# EAGLE schematic main_v2 (EAGLE 7.2.0)
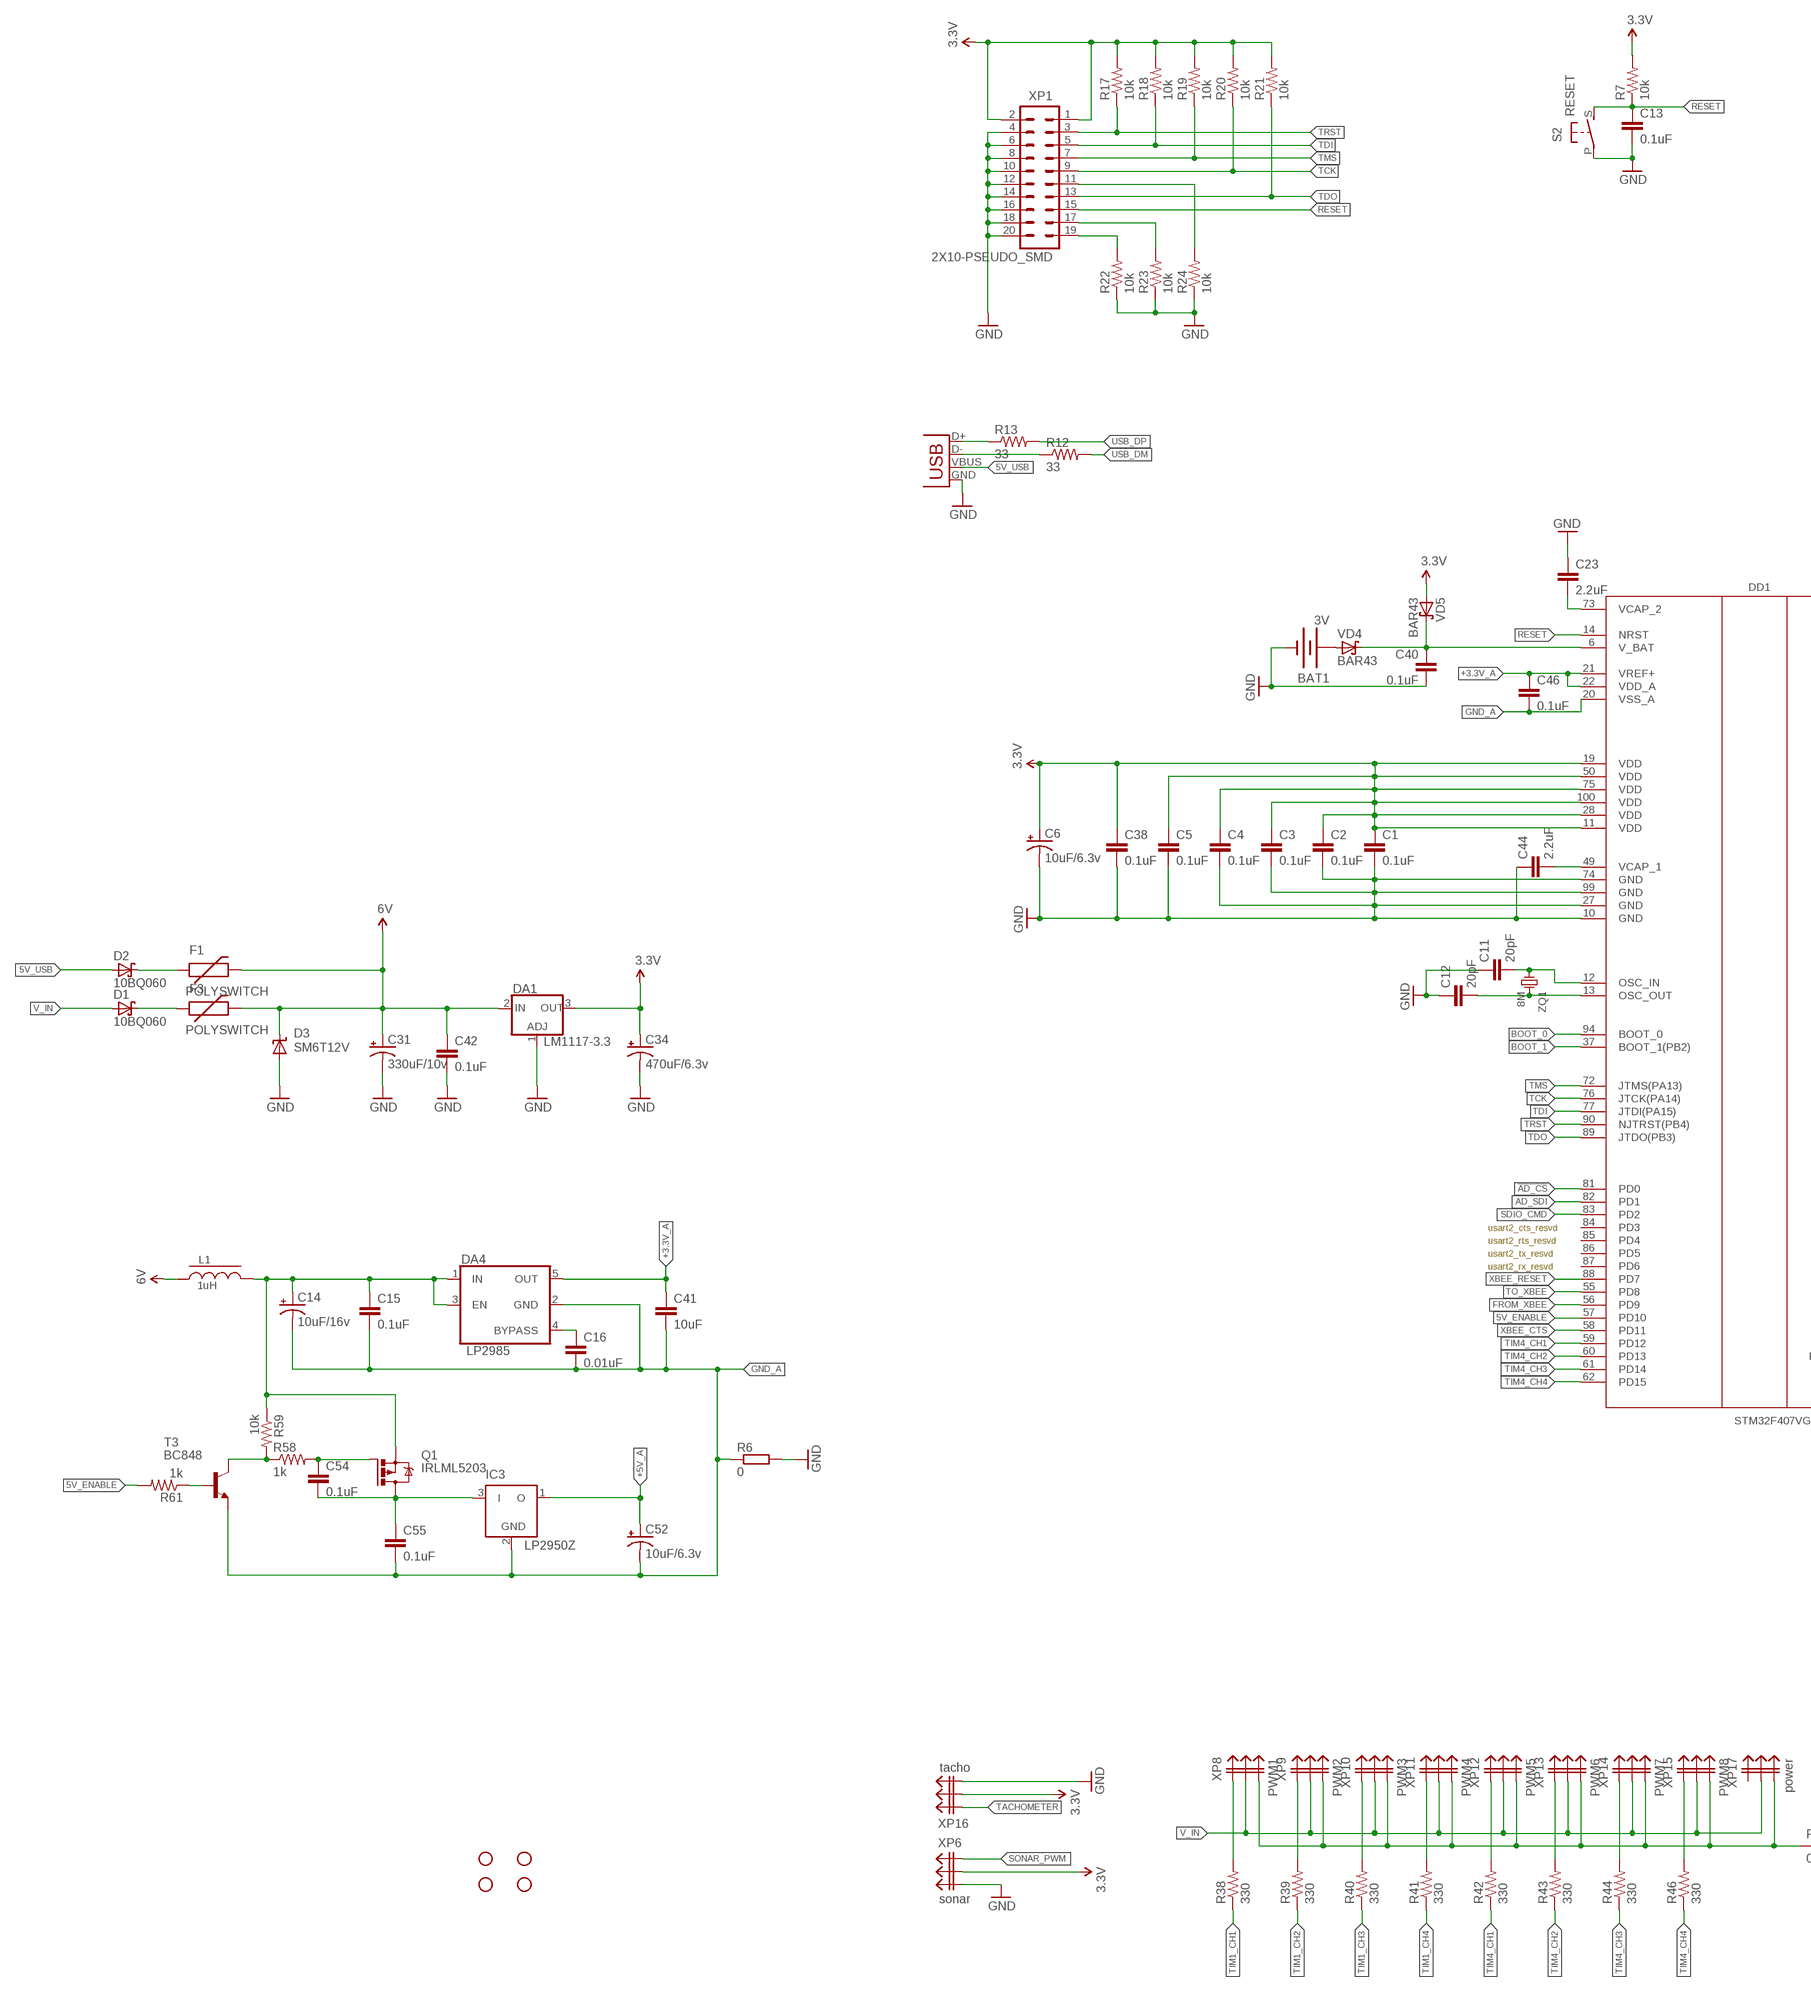
[diagram p0: schematic, sheet 1, part 1 of 3]
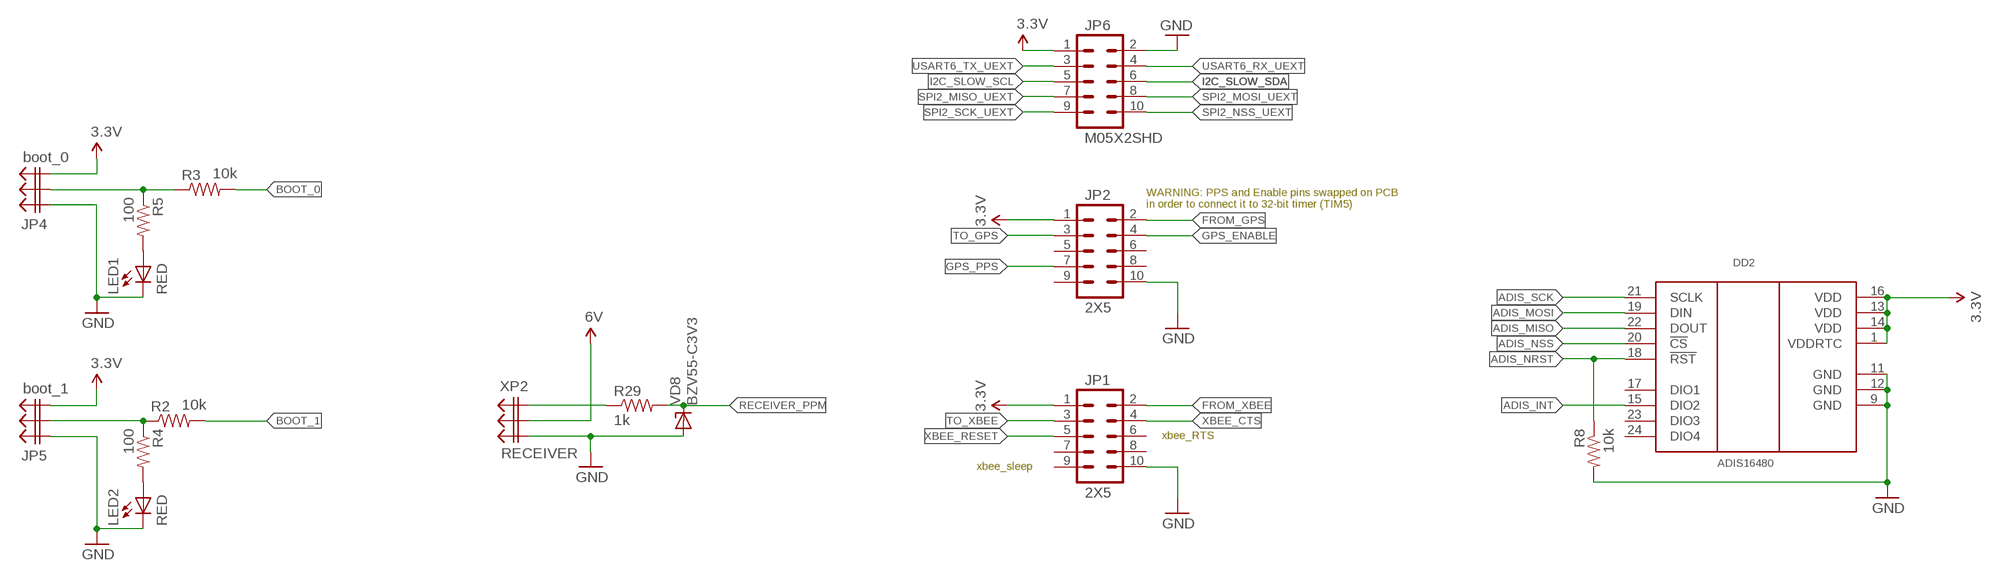
[diagram p1: schematic, sheet 1, part 2 of 3]
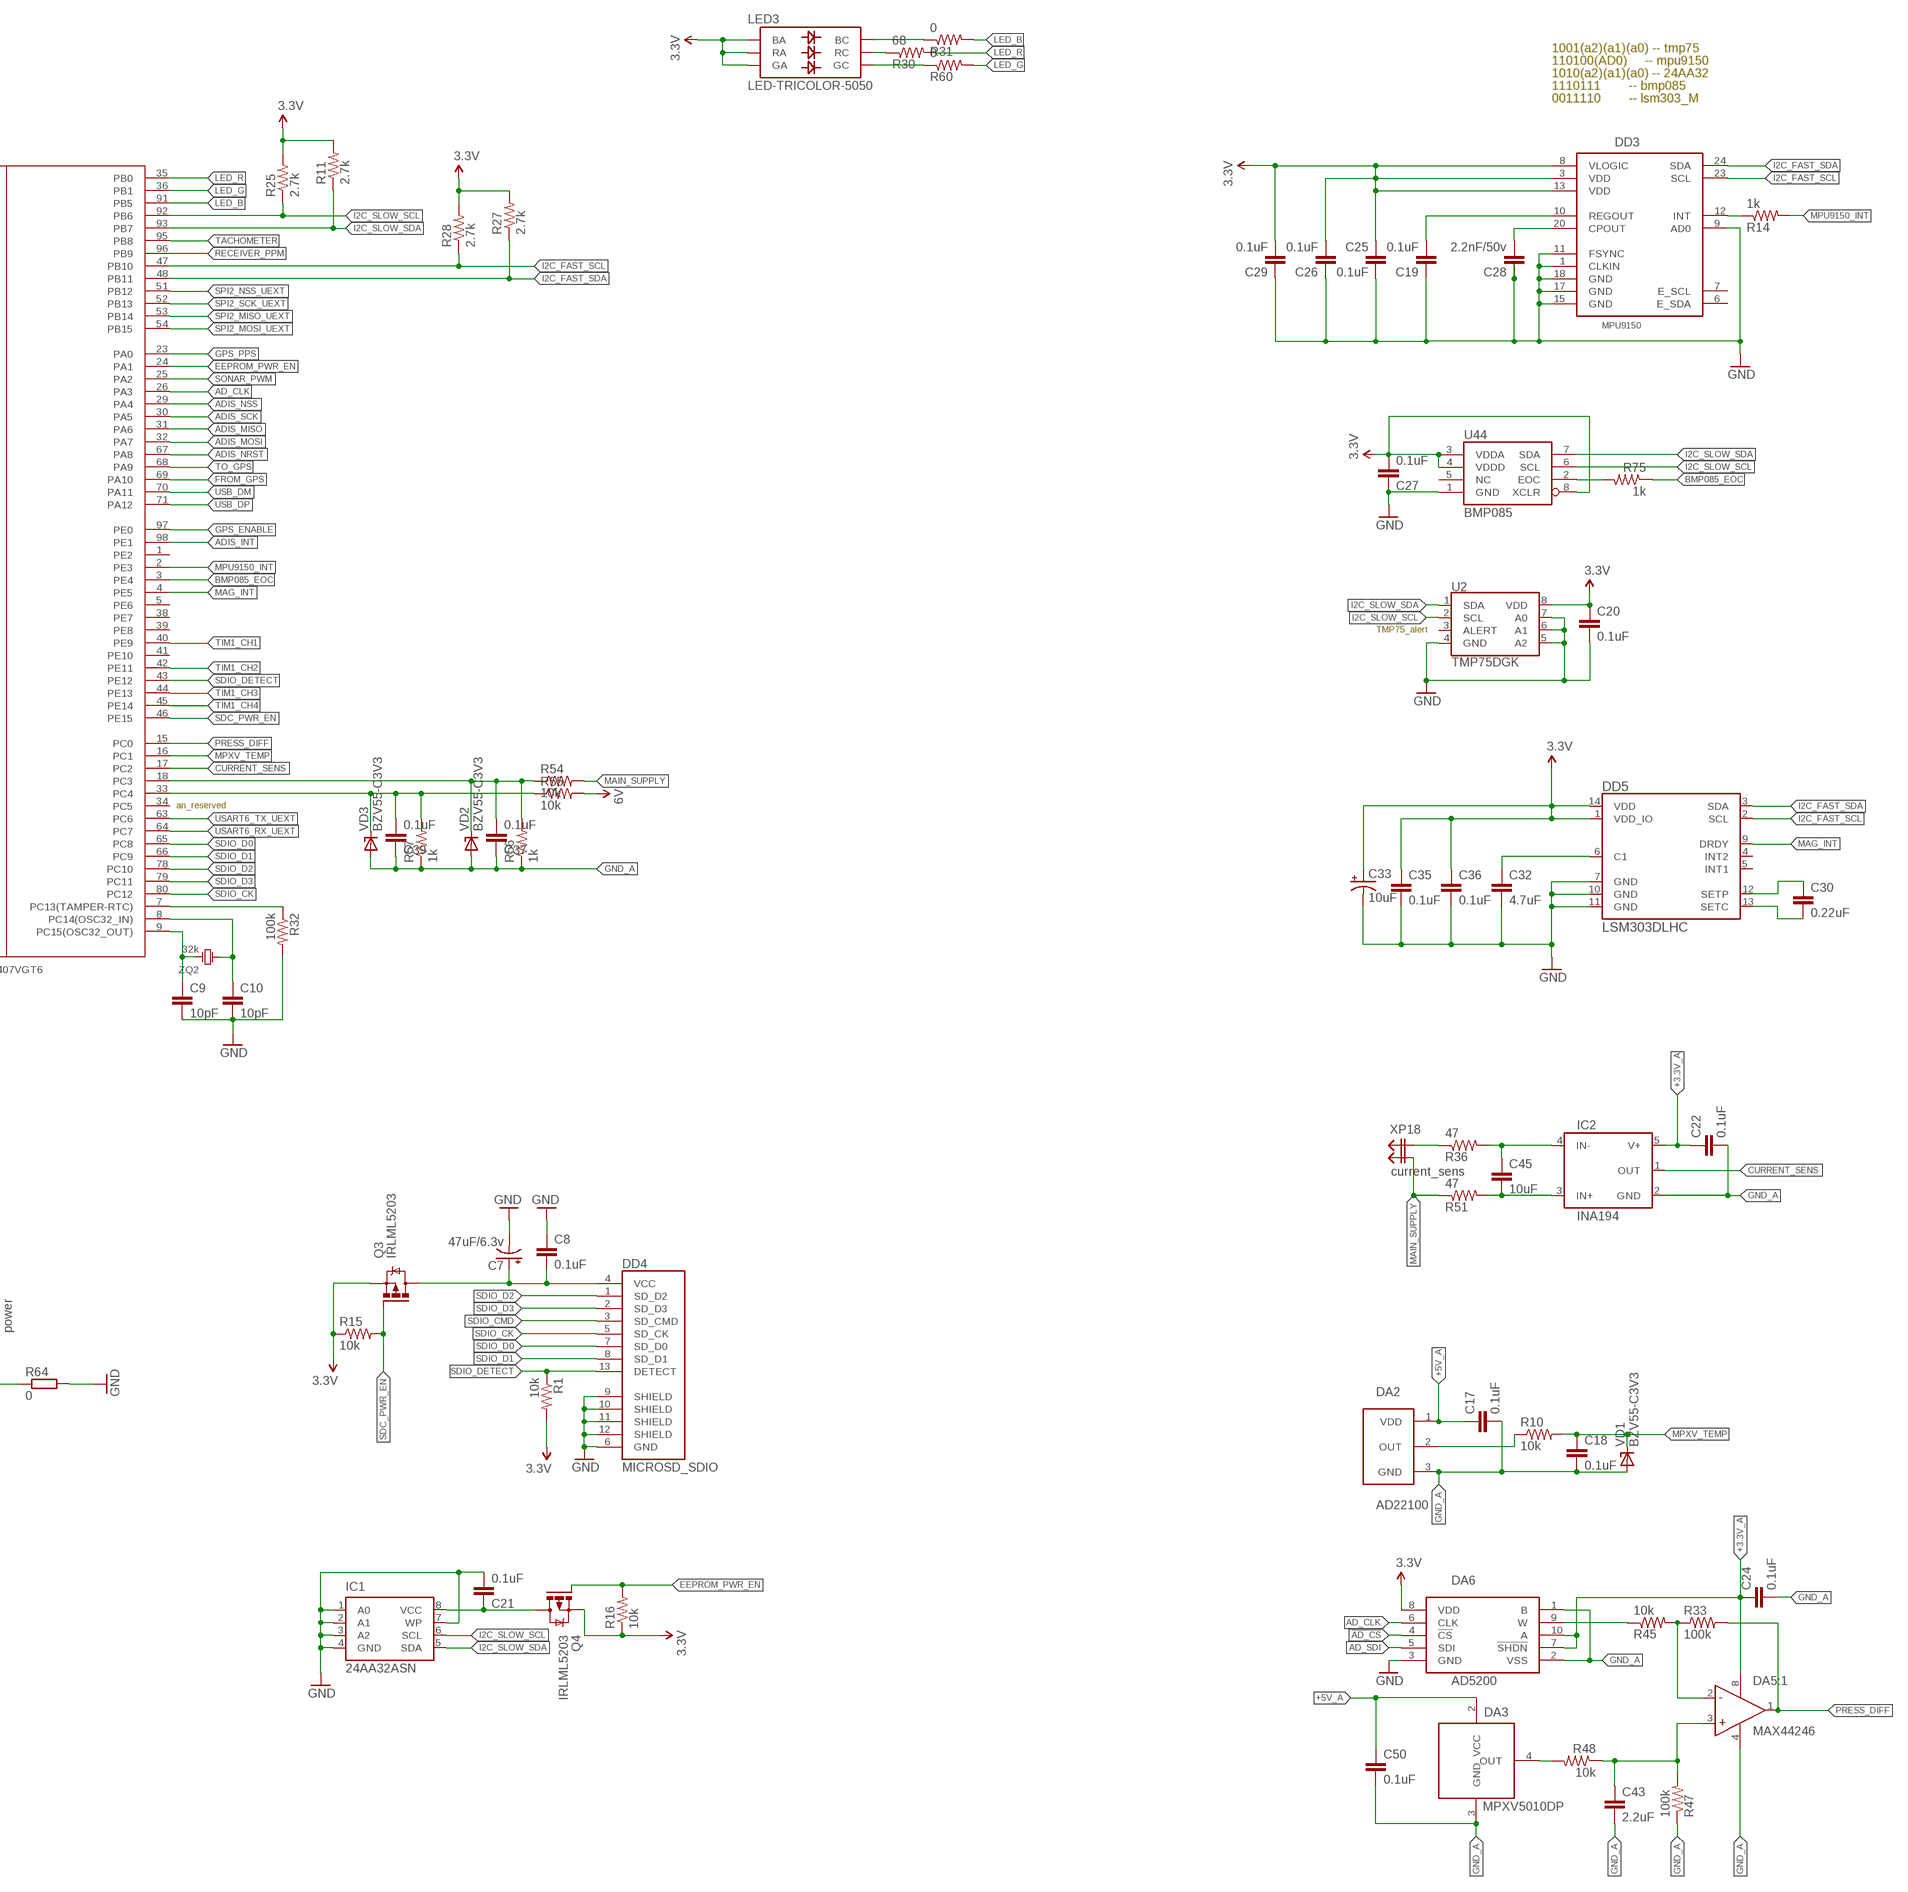
[diagram p2: schematic, sheet 1, part 3 of 3]

## Parts
BAT1  3V  BATTERY20PTH  [BATTCOM_20MM_PTH]
C1  0.1uF  CAP0805  [0805]
C2  0.1uF  CAP0805  [0805]
C3  0.1uF  CAP0805  [0805]
C4  0.1uF  CAP0805  [0805]
C5  0.1uF  CAP0805  [0805]
C6  10uF/6.3v  CAP_POL1206-KIT  [EIA3216-KIT]
C7  47uF/6.3v  CAP_POL1206-KIT  [EIA3216-KIT]
C8  0.1uF  CAP0805  [0805]
C9  10pF  CAP0805  [0805]
C10  10pF  CAP0805  [0805]
C11  20pF  CAP0805  [0805]
C12  20pF  CAP0805  [0805]
C13  0.1uF  CAP0805  [0805]
C14  10uF/16v  CAP_POL1206-KIT  [EIA3216-KIT]
C15  0.1uF  CAP0805  [0805]
C16  0.01uF  CAP0805  [0805]
C17  0.1uF  CAP0805  [0805]
C18  0.1uF  CAP0805  [0805]
C19  0.1uF  CAP0805  [0805]
C20  0.1uF  CAP0805  [0805]
C21  0.1uF  CAP0805  [0805]
C22  0.1uF  CAP0805  [0805]
C23  2.2uF  CAP0805  [0805]
C24  0.1uF  CAP0805  [0805]
C25  0.1uF  CAP0805  [0805]
C26  0.1uF  CAP0805  [0805]
C27  0.1uF  CAP0805  [0805]
C28  2.2nF/50v  CAP0805  [0805]
C29  0.1uF  CAP0805  [0805]
C30  0.22uF  CAP0805  [0805]
C31  330uF/10v  CAP_POL7343  [EIA7343]
C32  4.7uF  CAP0805  [0805]
C33  10uF  CAP_POL1206-KIT  [EIA3216-KIT]
C34  470uF/6.3v  CAP_POL7343  [EIA7343]
C35  0.1uF  CAP0805  [0805]
C36  0.1uF  CAP0805  [0805]
C37  0.1uF  CAP0805  [0805]
C38  0.1uF  CAP0805  [0805]
C39  0.1uF  CAP0805  [0805]
C40  0.1uF  CAP0805  [0805]
C41  10uF  CAP1206  [1206]
C42  0.1uF  CAP0805  [0805]
C43  2.2uF  CAP0805  [0805]
C44  2.2uF  CAP0805  [0805]
C45  10uF  CAP1206  [1206]
C46  0.1uF  CAP0805  [0805]
C50  0.1uF  CAP0805  [0805]
C52  10uF/6.3v  CAP_POL1206-KIT  [EIA3216-KIT]
C54  0.1uF  CAP0805  [0805]
C55  0.1uF  CAP0805  [0805]
D1  10BQ060  SCHOTTKY-DIODESMD  [SMB]
D2  10BQ060  SCHOTTKY-DIODESMD  [SMB]
D3  SM6T12V  SUPPRESSOR-SMBJ  [SMBJ]
DA1  LM1117-3.3  LM1117DTX  [TO252]
DA2  AD22100  [TO92]
DA3  MPXV5010DP  [482]
DA4  LP2985  [SOT23-5]
DA5  MAX44246  [MSOP8]
DA6  AD5200  [MSOP10]
DD1  STM32F407VGT6  [TQFP100]
DD2  ADIS16480  [ADIS16480]
DD3  MPU9150  MPU-9150QFN-24-NP  [QFN-24-NP]
DD4  MICROSD_SDIO  [MICROSD]
DD5  LSM303DLHC  [LGA14]
F1  POLYSWITCH  [1812]
F3  POLYSWITCH  [1812]
IC1  24AA32ASN  [SO-08]
IC2  INA194  [SOT23-5]
IC3  LP2950Z  [TO92]
JP1  2X5  [PLD_2X05_PSEUDOSMD]
JP2  2X5  [PLD_2X05_PSEUDOSMD]
JP3  STAND-OFF  [STAND-OFF]
JP4  boot_0  PLD_1X03  [PLD_1X03]
JP5  boot_1  PLD_1X03  [PLD_1X03]
JP6  M05X2SHD  [2X5-SHROUDED]
JP7  STAND-OFF  [STAND-OFF]
JP8  STAND-OFF  [STAND-OFF]
JP9  STAND-OFF  [STAND-OFF]
L1  1uH  EXC3BP  [L0603]
LED1  RED  LED0805  [LED-0805]
LED2  RED  LED0805  [LED-0805]
LED3  LED-TRICOLOR-5050  [LED-TRICOLOR-5050]
Q1  IRLML5203  [MICRO3]
Q3  IRLML5203  [MICRO3]
Q4  IRLML5203  [MICRO3]
R1  10k  RESISTOR0805-RES  [0805]
R2  10k  RESISTOR0805-RES  [0805]
R3  10k  RESISTOR0805-RES  [0805]
R4  100  RESISTOR0805-RES  [0805]
R5  100  RESISTOR0805-RES  [0805]
R6  0  RESISTOR1206  [1206]
R7  10k  RESISTOR0805-RES  [0805]
R8  10k  RESISTOR0805-RES  [0805]
R10  10k  RESISTOR0805-RES  [0805]
R11  2.7k  RESISTOR0805-RES  [0805]
R12  33  RESISTOR0805-RES  [0805]
R13  33  RESISTOR0805-RES  [0805]
R14  1k  RESISTOR0805-RES  [0805]
R15  10k  RESISTOR0805-RES  [0805]
R16  10k  RESISTOR0805-RES  [0805]
R17  10k  RESISTOR0805-RES  [0805]
R18  10k  RESISTOR0805-RES  [0805]
R19  10k  RESISTOR0805-RES  [0805]
R20  10k  RESISTOR0805-RES  [0805]
R21  10k  RESISTOR0805-RES  [0805]
R22  10k  RESISTOR0805-RES  [0805]
R23  10k  RESISTOR0805-RES  [0805]
R24  10k  RESISTOR0805-RES  [0805]
R25  2.7k  RESISTOR0805-RES  [0805]
R27  2.7k  RESISTOR0805-RES  [0805]
R28  2.7k  RESISTOR0805-RES  [0805]
R29  1k  RESISTOR0805-RES  [0805]
R30  68  RESISTOR0805-RES  [0805]
R31  0  RESISTOR0805-RES  [0805]
R32  100k  RESISTOR0805-RES  [0805]
R33  100k  RESISTOR0805-RES  [0805]
R36  47  RESISTOR0805-RES  [0805]
R38  330  RESISTOR0805-RES  [0805]
R39  330  RESISTOR0805-RES  [0805]
R40  330  RESISTOR0805-RES  [0805]
R41  330  RESISTOR0805-RES  [0805]
R42  330  RESISTOR0805-RES  [0805]
R43  330  RESISTOR0805-RES  [0805]
R44  330  RESISTOR0805-RES  [0805]
R45  10k  RESISTOR0805-RES  [0805]
R46  330  RESISTOR0805-RES  [0805]
R47  100k  RESISTOR0805-RES  [0805]
R48  10k  RESISTOR0805-RES  [0805]
R51  47  RESISTOR0805-RES  [0805]
R54  10k  RESISTOR0805-RES  [0805]
R55  10k  RESISTOR0805-RES  [0805]
R56  1k  RESISTOR0805-RES  [0805]
R57  1k  RESISTOR0805-RES  [0805]
R58  1k  RESISTOR0805-RES  [0805]
R59  10k  RESISTOR0805-RES  [0805]
R60  0  RESISTOR0805-RES  [0805]
R61  1k  RESISTOR0805-RES  [0805]
R64  0  RESISTOR1206  [1206]
R75  1k  RESISTOR0805-RES  [0805]
S2  RESET  BUTTON_6X3.5  [BUTTON_6X3.5]
T3  BC848  [SOT23]
U2  TMP75DGK  [MSOP8]
U44  BMP085  [BMP085]
VD1  BZV55-C3V3  [SOD80C]
VD2  BZV55-C3V3  [SOD80C]
VD3  BZV55-C3V3  [SOD80C]
VD4  BAR43  [SOT23-3]
VD5  BAR43  [SOT23-3]
VD8  BZV55-C3V3  [SOD80C]
X1  USB-SMD-NS  [USB-MINIB-NOSTOP]
XP1  2X10-PSEUDO_SMD  [PLD_2X10_PSEUDOSMD]
XP2  RECEIVER  PLD_1X03  [PLD_1X03]
XP6  sonar  PLD_1X03  [PLD_1X03]
XP8  PWM1  PLD_1X03  [PLD_1X03]
XP9  PWM2  PLD_1X03  [PLD_1X03]
XP10  PWM3  PLD_1X03  [PLD_1X03]
XP11  PWM4  PLD_1X03  [PLD_1X03]
XP12  PWM5  PLD_1X03  [PLD_1X03]
XP13  PWM6  PLD_1X03  [PLD_1X03]
XP14  PWM7  PLD_1X03  [PLD_1X03]
XP15  PWM8  PLD_1X03  [PLD_1X03]
XP16  tacho  PLD_1X03  [PLD_1X03]
XP17  power  PLD_1X03  [PLD_1X03]
XP18  current_sens  1X2DIP  [PLD_1X02]
ZQ1  8M  CRYSTAL5X3  [CRYSTAL-SMD-5X3]
ZQ2  32k  CRYSTAL3.2X.1.5  [CRYSTAL-32KHZ-SMD-3.2X1.5]

## Nets
3.3V: C1.1 C2.1 C3.1 C4.1 C5.1 C6.A(+) C20.1 C25.1 C26.2 C27.2 C29.2 C33.A(+) C34.A(+) C35.1 C36.1 C38.1 DA1.3(OUT) DA6.8(VDD) DD1.11(VDD) DD1.19(VDD) DD1.28(VDD) DD1.50(VDD) DD1.75(VDD) DD1.100(VDD) DD2.1(VDDRTC) DD2.13(VDD) DD2.14(VDD) DD2.16(VDD) DD3.3(VDD) DD3.8(VLOGIC) DD3.13(VDD) DD5.1(VDD_IO) DD5.14(VDD) JP1.1 JP2.1 JP4.3 JP5.3 JP6.1 LED3.1(BA) LED3.2(RA) LED3.3(GA) Q3.2(S) Q4.2(S) R1.2 R7.2 R11.2 R15.1 R16.1 R17.2 R18.2 R19.2 R20.2 R21.2 R25.2 R27.2 R28.2 U2.8(VDD) U44.3(VDDA) U44.4(VDDD) U44.8(XCLR) VD5.1(A) XP1.1 XP1.2 XP6.2 XP16.2
5V_ENABLE: DD1.57(PD10) R61.2
5V_USB: D2.A X1.VBUS
6V: C31.A(+) C42.1 D3.C DA1.2(IN) F1.2 F3.2 L1.1 R55.2 XP2.2
!AD_CS: DA6.4(!CS) DD1.81(PD0)
+3.3V_A: C22.1 C24.1 C41.1 C46.1 DA4.5(OUT) DA5.8(:1:+V) DA6.7(!SHDN) DA6.10(A) DD1.21(VREF+) DD1.22(VDD_A) IC2.5(V+)
+5V_A [+5V_A]: C17.1 C50.1 C52.A(+) DA2.1(VDD) DA3.2(VCC) IC3.1(O)
AD_CLK: DA6.6(CLK) DD1.26(PA3)
AD_SDI: DA6.5(SDI) DD1.82(PD1)
ADIS_INT: DD1.98(PE1) DD2.15(DIO2)
ADIS_MISO: DD1.31(PA6) DD2.22(DOUT)
ADIS_MOSI: DD1.32(PA7) DD2.19(DIN)
ADIS_NRST: DD1.67(PA8) DD2.18(!RST) R8.1
ADIS_NSS: DD1.29(PA4) DD2.20(!CS)
ADIS_SCK: DD1.30(PA5) DD2.21(SCLK)
BMP085_EOC: DD1.3(PE4) R75.1
BOOT_0: DD1.94(BOOT_0) R3.2
BOOT_1: DD1.37(BOOT_1(PB2)) R2.2
CURRENT_SENS: DD1.17(PC2) IC2.1(OUT)
EEPROM_PWR_EN: DD1.24(PA1) Q4.1(G) R16.2
FROM_GPS: DD1.69(PA10) JP2.2
FROM_XBEE: DD1.56(PD9) JP1.2
GND: BAT1.2(-) C1.2 C2.2 C3.2 C4.2 C5.2 C6.C(-) C7.C(-) C8.1 C9.2 C10.2 C11.1 C12.1 C13.2 C19.1 C20.2 C21.2 C23.1 C25.2 C26.1 C27.1 C28.1 C29.1 C31.C(-) C32.2 C33.C(-) C34.C(-) C35.2 C36.2 C38.2 C40.2 C42.2 C44.1 D3.A DA1.1(ADJ) DA6.3(GND) DD1.10(GND) DD1.27(GND) DD1.74(GND) DD1.99(GND) DD2.9(GND) DD2.11(GND) DD2.12(GND) DD3.1(CLKIN) DD3.9(AD0) DD3.11(FSYNC) DD3.15(GND) DD3.17(GND) DD3.18(GND) DD4.6(GND) DD4.9(SHIELD) DD4.10(SHIELD) DD4.11(SHIELD) DD4.12(SHIELD) DD5.7(GND) DD5.10(GND) DD5.11(GND) IC1.1(A0) IC1.2(A1) IC1.3(A2) IC1.4(GND) IC1.7(WP) JP1.10 JP2.10 JP4.1 JP5.1 JP6.2 LED1.C LED2.C R6.2 R8.2 R22.1 R23.1 R24.1 R32.2 R64.2 S2.P U2.4(GND) U2.5(A2) U2.6(A1) U2.7(A0) U44.1(GND) VD8.A X1.GND XP1.4 XP1.6 XP1.8 XP1.10 XP1.12 XP1.14 XP1.16 XP1.18 XP1.20 XP2.3 XP6.3 XP16.3
GND_A: C14.C(-) C15.2 C16.2 C17.2 C18.2 C22.2 C24.2 C37.1 C39.1 C41.2 C43.2 C46.2 C50.2 C52.C(-) C55.2 DA2.3(GND) DA3.3(GND) DA4.2(GND) DA5.4(:1:-V) DA6.1(B) DA6.2(VSS) DD1.20(VSS_A) IC2.2(GND) IC3.2(GND) R6.1 R47.1 R56.1 R57.1 T3.2(E) VD1.A VD2.A VD3.A
GPS_ENABLE: DD1.97(PE0) JP2.4
GPS_PPS: DD1.23(PA0) JP2.7
I2C_FAST_SCL: DD1.47(PB10) DD3.23(SCL) DD5.2(SCL) R28.1
I2C_FAST_SDA: DD1.48(PB11) DD3.24(SDA) DD5.3(SDA) R27.1
I2C_SLOW_SCL: DD1.92(PB6) IC1.6(SCL) JP6.5 R25.1 U2.2(SCL) U44.6(SCL)
I2C_SLOW_SDA: DD1.93(PB7) IC1.5(SDA) JP6.6 R11.1 U2.1(SDA) U44.7(SDA)
LED_B: DD1.91(PB5) R31.2
LED_G: DD1.36(PB1) R60.2
LED_R: DD1.35(PB0) R30.2
MAG_INT: DD1.4(PE5) DD5.9(DRDY)
MAIN_SUPPLY: R51.1 R54.2 XP18.2
MPU9150_INT: DD1.2(PE3) R14.2
MPXV_TEMP: C18.1 DD1.16(PC1) R10.2 VD1.C
N$1: C9.1 DD1.9(PC15(OSC32_OUT)) ZQ2.2
N$2: LED2.A R4.2
N$3: JP5.2 R2.1 R4.1
N$4: LED1.A R5.2
N$5: JP4.2 R3.1 R5.1
N$6: C10.1 DD1.8(PC14(OSC32_IN)) ZQ2.1
N$7: C12.2 DD1.13(OSC_OUT) ZQ1.3
N$8: LED3.6(BC) R31.1
N$9: C11.2 DD1.12(OSC_IN) ZQ1.1
N$10: R12.1 X1.D-
N$11: DA6.9(W) R45.1
N$12: LED3.5(RC) R30.1
N$13: R13.1 X1.D+
N$14: D1.C F3.1
N$15: C16.1 DA4.4(BYPASS)
N$16: DA2.2(OUT) R10.1
N$17: R22.2 XP1.19
N$18: R23.2 XP1.17
N$19: R24.2 XP1.11
N$20: C45.1 IC2.4(IN-) R36.2
N$21: C28.2 DD3.20(CPOUT)
N$22: C19.2 DD3.10(REGOUT)
N$23: C7.A(+) C8.2 DD4.4(VCC) Q3.3(D)
N$24: C30.1 DD5.12(SETP)
N$25: C21.1 IC1.8(VCC) Q4.3(D)
N$26: DD3.12(INT) R14.1
N$27: C30.2 DD5.13(SETC)
N$28: C32.1 DD5.6(C1)
N$29: BAT1.1(+) VD4.1(A)
N$30: C14.A(+) C15.1 DA4.1(IN) DA4.3(EN) L1.2 Q1.2(S) R59.1
N$31: LED3.4(GC) R60.1
N$32: R29.1 XP2.1
N$33: C40.1 DD1.6(V_BAT) VD4.3(C) VD5.3(C)
N$34: DD1.7(PC13(TAMPER-RTC)) R32.1
N$35: DA3.4(OUT) R48.2
N$36: D2.C F1.1
N$37: C45.2 IC2.3(IN+) R51.2
N$39: R36.1 XP18.1
N$46: DA5.2(:1:-IN) R33.1 R45.2
N$47: C43.1 DA5.3(:1:+IN) R47.2 R48.1
N$52: C37.2 DD1.18(PC3) R54.1 R56.2 VD2.C
N$53: C54.1 Q1.1(G) R58.2
N$54: C39.2 DD1.33(PC4) R55.1 R57.2 VD3.C
N$55: C54.2 C55.1 IC3.3(I) Q1.3(D)
N$59: R61.1 T3.1(B)
N$74: R75.2 U44.2(EOC)
N$78: R64.1 XP8.3 XP9.3 XP10.3 XP11.3 XP12.3 XP13.3 XP14.3 XP15.3 XP17.3
N$81: C23.2 DD1.73(VCAP_2)
N$82: C44.2 DD1.49(VCAP_1)
NET$1: R58.1 R59.2 T3.3(C)
PRESS_DIFF: DA5.1(:1:OUT) DD1.15(PC0) R33.2
PWM1: R38.2 XP8.1
PWM2: R39.2 XP9.1
PWM3: R40.2 XP10.1
PWM4: R41.2 XP11.1
PWM5: R42.2 XP12.1
PWM6: R43.2 XP13.1
PWM7: R44.2 XP14.1
PWM8: R46.2 XP15.1
RECEIVER_PPM: DD1.96(PB9) R29.2 VD8.C
RESET: C13.1 DD1.14(NRST) R7.1 S2.S XP1.15
SDC_PWR_EN: DD1.46(PE15) Q3.1(G) R15.2
SDIO_CK: DD1.80(PC12) DD4.5(SD_CK)
SDIO_CMD: DD1.83(PD2) DD4.3(SD_CMD)
SDIO_D0: DD1.65(PC8) DD4.7(SD_D0)
SDIO_D1: DD1.66(PC9) DD4.8(SD_D1)
SDIO_D2: DD1.78(PC10) DD4.1(SD_D2)
SDIO_D3: DD1.79(PC11) DD4.2(SD_D3)
SDIO_DETECT: DD1.43(PE12) DD4.13(DETECT) R1.1
SONAR_PWM: DD1.25(PA2) XP6.1
SPI2_MISO_UEXT: DD1.53(PB14) JP6.7
SPI2_MOSI_UEXT: DD1.54(PB15) JP6.8
SPI2_NSS_UEXT: DD1.51(PB12) JP6.10
SPI2_SCK_UEXT: DD1.52(PB13) JP6.9
TACHOMETER: DD1.95(PB8) XP16.1
TCK: DD1.76(JTCK(PA14)) R20.1 XP1.9
TDI: DD1.77(JTDI(PA15)) R18.1 XP1.5
TDO: DD1.89(JTDO(PB3)) R21.1 XP1.13
TIM1_CH1: DD1.40(PE9) R38.1
TIM1_CH2: DD1.42(PE11) R39.1
TIM1_CH3: DD1.44(PE13) R40.1
TIM1_CH4: DD1.45(PE14) R41.1
TIM4_CH1: DD1.59(PD12) R42.1
TIM4_CH2: DD1.60(PD13) R43.1
TIM4_CH3: DD1.61(PD14) R44.1
TIM4_CH4: DD1.62(PD15) R46.1
TMS: DD1.72(JTMS(PA13)) R19.1 XP1.7
TO_GPS: DD1.68(PA9) JP2.3
TO_XBEE: DD1.55(PD8) JP1.3
TRST: DD1.90(NJTRST(PB4)) R17.1 XP1.3
USART6_RX_UEXT: DD1.64(PC7) JP6.4
USART6_TX_UEXT: DD1.63(PC6) JP6.3
USB_DM: DD1.70(PA11) R12.2
USB_DP: DD1.71(PA12) R13.2
V_IN: D1.A XP8.2 XP9.2 XP10.2 XP11.2 XP12.2 XP13.2 XP14.2 XP15.2 XP17.2
XBEE_CTS: DD1.58(PD11) JP1.4
XBEE_RESET: DD1.88(PD7) JP1.5
Unconnected: DA5.5(:2:+IN) DA5.6(:2:-IN) DA5.7(:2:OUT) DD1.1(PE2) DD1.5(PE6) DD1.34(PC5) DD1.38(PE7) DD1.39(PE8) DD1.41(PE10) DD1.84(PD3) DD1.85(PD4) DD1.86(PD5) DD1.87(PD6) DD2.17(DIO1) DD2.23(DIO3) DD2.24(DIO4) DD3.6(E_SDA) DD3.7(E_SCL) DD5.4(INT2) DD5.5(INT1) JP1.6 JP1.7 JP1.8 JP1.9 JP2.5 JP2.6 JP2.8 JP2.9 U2.3(ALERT) U44.5(NC) XP17.1

## Notes on the sheet
- WARNING: PPS and Enable pins swapped on PCB
  in order to connect it to 32-bit timer (TIM5)
- xbee_RTS
- xbee_sleep
- 1001(a2)(a1)(a0) -- tmp75
- 110100(AD0)     -- mpu9150
- 1010(a2)(a1)(a0) -- 24AA32
- 1110111        -- bmp085
- 0011110        -- lsm303_M
- TMP75_alert
- usart2_cts_resvd
- usart2_rts_resvd
- usart2_tx_resvd | an_reserved
- usart2_rx_resvd

## Library data of the parts
BAT1 = SparkFun:BATTERY: Battery Holders Various common sizes : AA, AAA, 20mm coin cell and 12mm coin cell.
C1-C5 C8-C13 C15-C30 C32 C35-C46 C50 C54 C55 = SparkFun:CAP: Capacitor Standard 0603 ceramic capacitor, and 0.1" leaded capacitor.
C6 C7 C14 C33 C52 = SparkFun:CAP_POL: Capacitor Polarized These are standard SMD and PTH capacitors. Normally 10uF, 47uF, and 100uF in electrolytic and tantalum varieties. Always verify the external diameter of the through hole cap, it varies with capacity, voltage, and manufacturer. The EIA devices should be standard.
C31 C34 = barthess:CAP_POL: Capacitor Polarized These are standard SMD and PTH capacitors. Normally 10uF, 47uF, and 100uF in electrolytic and tantalum varieties. Always verify the external diameter of the through hole cap, it varies with capacity, voltage, and manufacturer. The EIA devices should be standard.
D1 D2 = diode:SCHOTTKY-DIODE: Schottky Diode
D3 = diode:SUPPRESSOR-: Suppressor diode
DA1 = barthess:LM1117DTX: Voltage Regulator LM1117 Standard adjustable voltage regulator but in SMD form. Spark Fun Electronics SKU : COM-00595
DA2 = barthess:AD22100
DA3 = barthess:MPXV5010DP
DA4 = barthess:LP2985
DA5 = barthess:MAX44246: Low-noise, high-speed rail-to-rail CMOS op-amp
DA6 = barthess:AD5200
DD1 = barthess:STM32F407V
DD2 = barthess:ADIS16480
DD3 = barthess:MPU-9150: 9DOF (3mag, 3accel, 3rotat). I2C interface.
DD4 = barthess:MICROSD_SDIO: microSD Socket Push-push type uSD socket. Schematic element for SDIO pin names.
DD5 = barthess:LSM303DLHC: I2C accelerometer/magnetometer/tilt compensated compass
F1 F3 = barthess:POLYSWITCH: Resettable Fuse PTC Resettable Fuse. Spark Fun Electronics SKU : COM-08357
IC1 = barthess:24*: Serial EEPROM I2C; MF: MICROCHIP; MPN: 24AA32A-I/SN; OC_FARNELL: 1617659; OC_NEWARK: 83C5815
IC2 = barthess:INA194: High-Side Measurement Current Shunt Monitor; MF: TEXAS INSTRUMENTS; MPN: INA168NA/250; OC_FARNELL: 4375737; OC_NEWARK: 35C1744
IC3 = linear:LP2950: 100 mA, Low Power Low Dropout Voltage Regulator Source: http://www.onsemi.com/pub/Collateral/LP2950-D.PDF
JP1 JP2 = barthess:2X5: Standard 2x5 header.
JP3 JP7-JP9 = barthess:STAND-OFF: Stand Off This is the mechanical footprint for a #4 phillips button head screw. Use the keepout ring to avoid running the screw head into surrounding components. SKU : PRT-00447
JP4 JP5 XP2 XP6 XP8-XP17 = barthess:PLD_1X03
JP6 = barthess:M05X2: Header 5x2 Standard 10-pin dual row 0.1" header. Commonly used with AVR-ISP. Use with Spark Fun Electronics SKU: PRT-00778
L1 = ferrite:EXC3BP: Chip Bead Core
LED1 LED2 = barthess:LED: LEDs SMD Leds
LED3 = barthess:LED-TRICOLOR-5050
Q1 Q3 Q4 = transistor-power:IRLML5203: HEXFET P-Channel Power MOSFET
R1-R5 R7 R8 R10-R25 R27-R33 R36 R38-R48 R51 R54-R61 R75 = SparkFun:RESISTOR: Resistor Basic schematic elements and footprints for 0603, 1206, and PTH resistors.
R6 R64 = barthess:RESISTOR: Resistor Basic schematic elements and footprints for 0603, 1206, and PTH resistors.
S2 = barthess:BUTTON_6X3.5: OMRON SWITCH
T3 = transistor:BC848: NPN TRANSISTOR
U2 = barthess:TMP75
U44 = barthess:BMP085: BMP085 Pressure Sensor Great little MEMS pressure sensor. SKU: COM-09603
VD1-VD3 VD8 = barthess:BZV55: DIODE high speed; PARTNO: ?
VD4 VD5 = barthess:BAR43: Silicon Schottky Diodes General-purpose diode
X1 = SparkFun:USB: USB Connectors USB-B-PTH is fully proven SKU : PRT-00139 USB-miniB is fully proven SKU : PRT-00587 USB-A-PCB is untested. USB-A-H is throughly reviewed, but untested. Spark Fun Electronics SKU : PRT-00437 USB-B-SMT is throughly reviewed, but untested. Needs silkscreen touching up. USB-A-S has not been used/tested USB-MB-H has not been used/tested
XP1 = barthess:2X10: Standard 10x2 JTAG header for ARM.
XP18 = barthess:1X2: Standard 1x2 header.
ZQ1 ZQ2 = crystal:CRYSTAL: Crystals Various standard crystals. Proven footprints. Spark Fun Electronics SKU : COM-00534

## Net classes
1 +5V_A: width 0.4 mm, drill 0.5 mm
2 +3.3V_A: width 0.4 mm, drill 0.5 mm
3 GND_A: width 0.4 mm, drill 0.5 mm